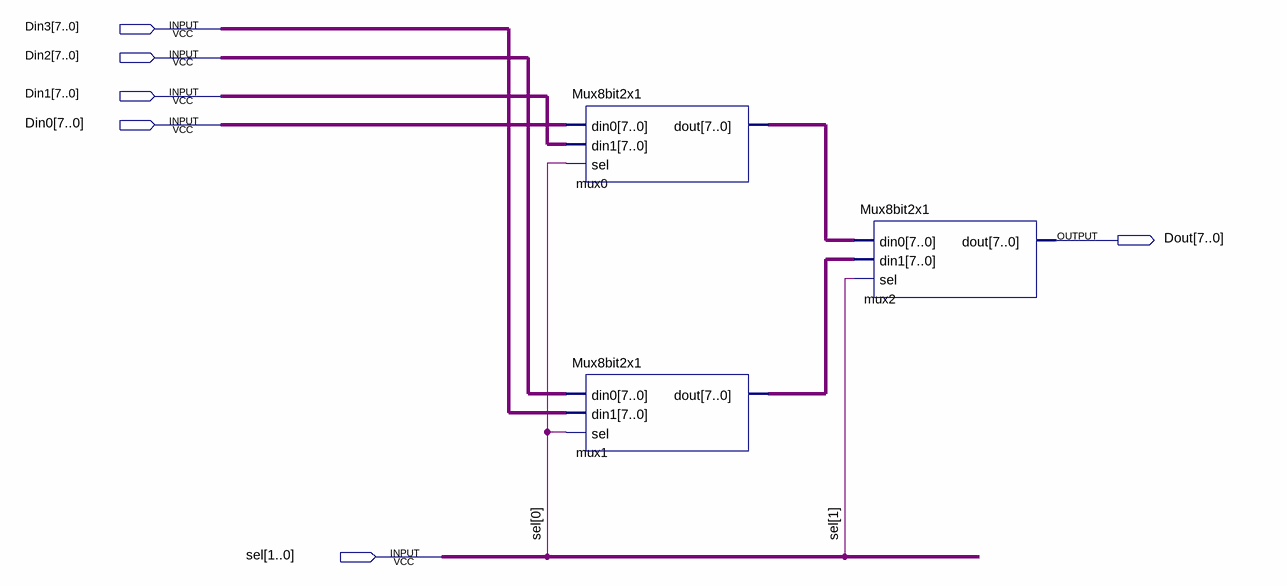
[diagram p0: schematic sheet]
// Quartus schematic Mux8bit4x1.bdf as structural Verilog: 3 symbols, 6 pins
module Mux8bit4x1 (
  input  [7:0] Din3,
  input  [7:0] Din2,
  input  [7:0] Din1,
  input  [7:0] Din0,
  input  [1:0] sel,
  output [7:0] Dout
);

  wire [7:0] mux0_dout, mux1_dout;

  Mux8bit2x1 mux0 (.din0(Din0), .din1(Din1), .sel(sel[0]), .dout(mux0_dout));
  Mux8bit2x1 mux1 (.din0(Din2), .din1(Din3), .sel(sel[0]), .dout(mux1_dout));
  Mux8bit2x1 mux2 (.din0(mux0_dout), .din1(mux1_dout), .sel(sel[1]), .dout(Dout));
endmodule
